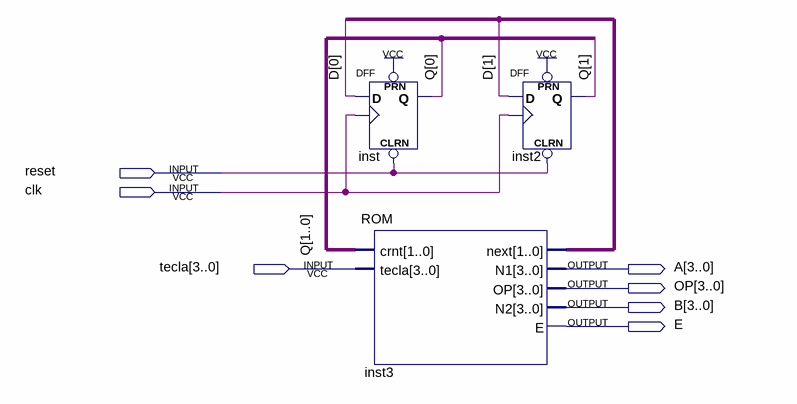
[diagram p0: schematic sheet]
// Quartus schematic maquina de estados.bdf as structural Verilog: 3 symbols, 7 pins
module \maquina_de_estados  (
  input  reset,
  input  clk,
  input  [3:0] tecla,
  output [3:0] A,
  output [3:0] OP,
  output [3:0] B,
  output E
);

  wire [1:0] D, inst3_next, Q;

  DFF inst (.CLRN(reset), .CLK(clk), .D(D[0]), .PRN(1'b1), .Q(Q[0]));
  ROM inst3 (.crnt(Q), .tecla(tecla), .next(inst3_next), .N1(A), .OP(OP), .N2(B), .E(E));
  DFF inst2 (.CLRN(reset), .CLK(clk), .D(D[1]), .PRN(1'b1), .Q(Q[1]));
endmodule
